# Altium schematic sheet NandFlash.SchDoc: main_assy PCB
size A4
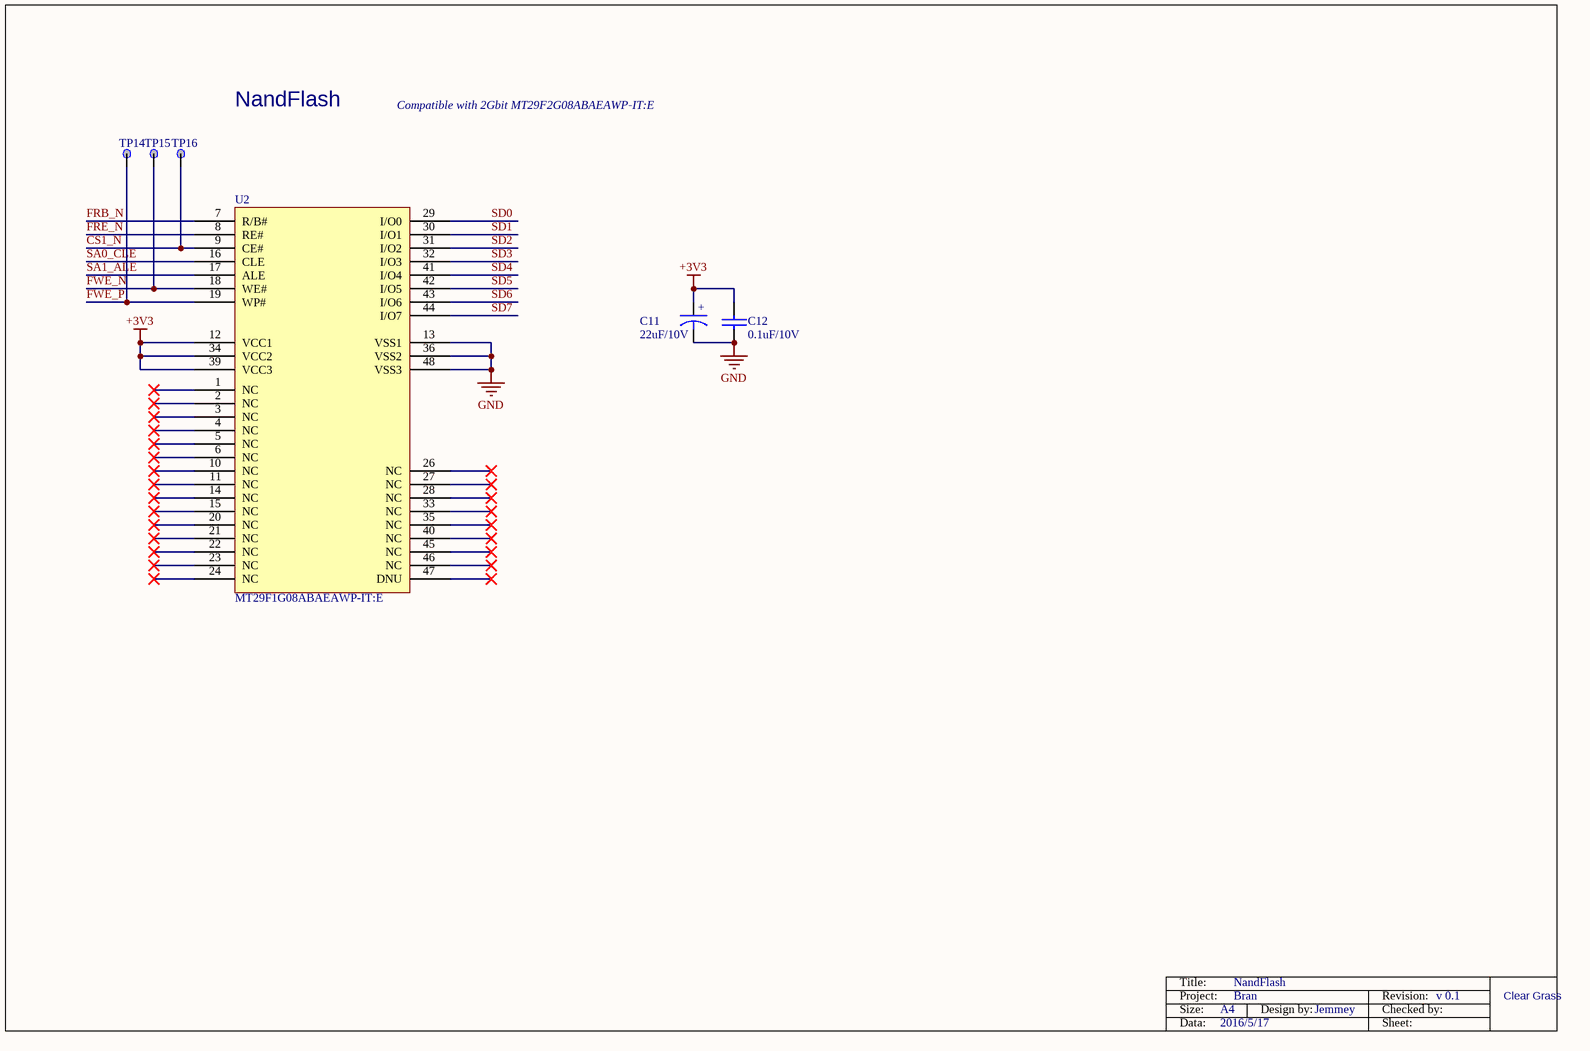
[diagram p0: NandFlash.SchDoc]

## Parts
C11  22uF/10V  [6032]
C12  0.1uF/10V  [0402C]
TP14  TP  [TP_C40]  (value not drawn)
TP15  TP  [TP_C40]  (value not drawn)
TP16  TP  [TP_C40]  (value not drawn)
U2  MT29F1G08ABAEAWP-IT:E

## Nets
+3V3: C11.1 C12.2 U2.12(VCC1) U2.34(VCC2) U2.39(VCC3)
GND: C11.2 C12.1 U2.13(VSS1) U2.36(VSS2) U2.48(VSS3)
CS1_N: TP16.1 U2.9(CE#)
FRB_N: U2.7(R/B#)
FRE_N: U2.8(RE#)
FWE_N: TP15.1 U2.18(WE#)
FWE_P: TP14.1 U2.19(WP#)
SA0_CLE: U2.16(CLE)
SA1_ALE: U2.17(ALE)
SD0: U2.29(I/O0)
SD1: U2.30(I/O1)
SD2: U2.31(I/O2)
SD3: U2.32(I/O3)
SD4: U2.41(I/O4)
SD5: U2.42(I/O5)
SD6: U2.43(I/O6)
SD7: U2.44(I/O7)

Not connected (* = marked no-connect by the designer): U2 1(NC)* 2(NC)* 3(NC)* 4(NC)* 5(NC)* 6(NC)* 10(NC)* 11(NC)* 14(NC)* 15(NC)* 20(NC)* 21(NC)* 22(NC)* 23(NC)* 24(NC)* 26(NC)* 27(NC)* 28(NC)* 33(NC)* 35(NC)* 40(NC)* 45(NC)* 46(NC)* 47(DNU)*

## Notes on the sheet
- NandFlash
- Compatible with 2Gbit MT29F2G08ABAEAWP-IT:E
- Title:
- Project:
- Size:
- Data:
- A4
- 2016/5/17
- Bran
- Design by:
- Jemmey
- Revision:
- Sheet:
- Checked by:
- v 0.1
- Clear Grass
- (in symbol Capacitor) +

## Library data of the parts
C11 = Capacitor
C12 = CAP: 厂家：Murata，型号：GRM155R71A104KA01D
TP14-TP16 = TP: Ordered by: Subcon
U2 = NandFlash